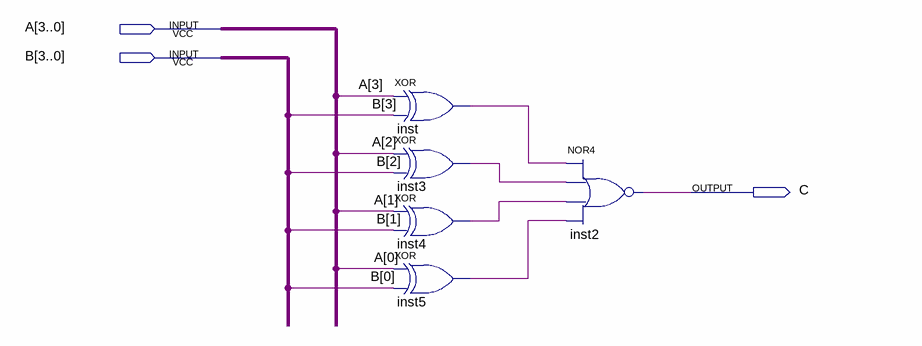
[diagram p0: schematic sheet]
// Quartus schematic comparison4bit.bdf as structural Verilog: 5 symbols, 3 pins
module comparison4bit (
  input  [3:0] A,
  input  [3:0] B,
  output C
);

  wire inst3_out, inst4_out, inst5_out, inst_out;

  xor inst (inst_out, A[3], B[3]);
  xor inst3 (inst3_out, A[2], B[2]);
  xor inst4 (inst4_out, A[1], B[1]);
  xor inst5 (inst5_out, A[0], B[0]);
  nor inst2 (C, inst_out, inst3_out, inst4_out, inst5_out);
endmodule
